# Altium schematic sheet clock-temp-touch.SchDoc
size A3; SPICEModelCacheRLVYLVLF: <root> / <DocumentId>RLVYLVLF</DocumentId> / <CacheFrame Number="0"> / <Model Name="dtunnel1" Kind="CKT"> / <Text>*Tunnel Diode Default / *MCE 600V 50A 27.2ns default parameters / *Diode Pinout: A,K / * Parameters: / * RS:  Series resistance value / * RP:  Negative resistance value in parallel with capacitance. / * CP:   Capacitance value in parallel with negative resistance. / * LS:  Series inductance value. / * / * / .SUBCKT DTUNNEL1 1 2 PARAMS: Rs=6 Rp=-75 Cp=0.6E-12 Ls=0.1nH / RS  1 3  {Rs} / RP  3 4  {Rp} / CP  3 4  {Cp} / LS  4 2  {Ls} / .ENDS DTUNNEL1</Text> / </Model> / </CacheFrame> / </root>
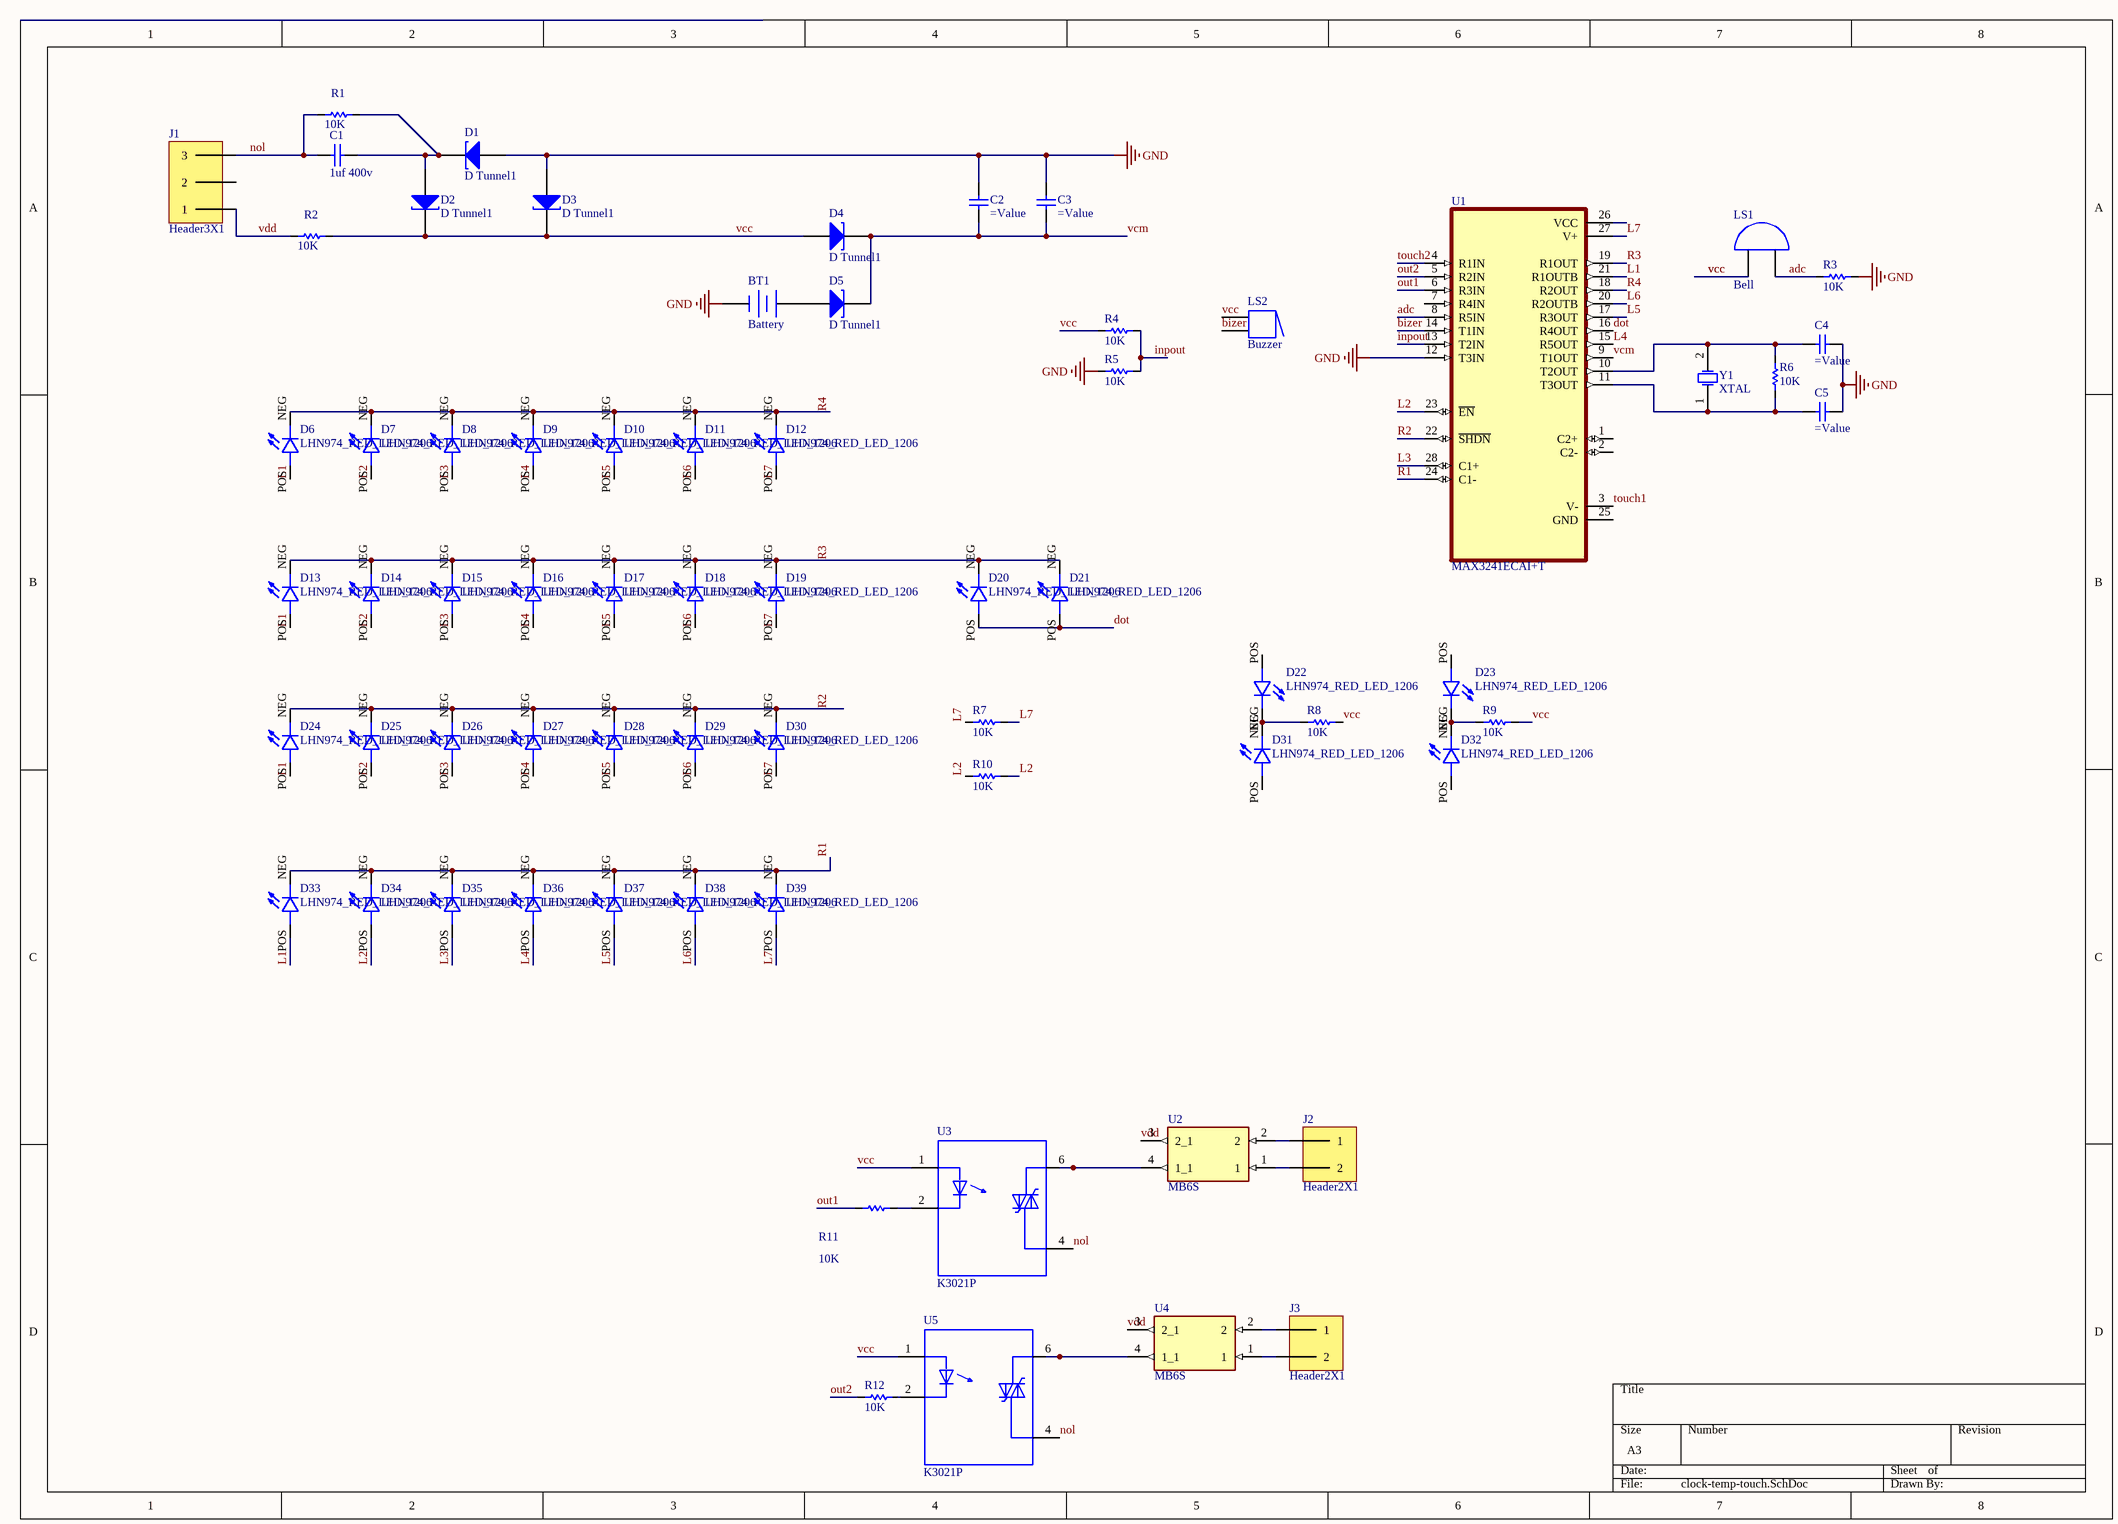
[diagram p0: clock-temp-touch.SchDoc]

## Parts
BT1  Battery  [BAT-2]
C1  1uf 400v  [1uf 400v]
C2  (no value)  [CAP 1206]
C3  (no value)  [CAP 1206]
C4  (no value)  [CAP 1206]
C5  (no value)  [CAP 1206]
D1  D Tunnel1  [3.2X1.6X1.1]
D2  D Tunnel1  [3.2X1.6X1.1]
D3  D Tunnel1  [3.2X1.6X1.1]
D4  D Tunnel1  [3.2X1.6X1.1]
D5  D Tunnel1  [3.2X1.6X1.1]
D6  LHN974_RED_LED_1206  [LEDC3216X120N]
D7  LHN974_RED_LED_1206  [LEDC3216X120N]
D8  LHN974_RED_LED_1206  [LEDC3216X120N]
D9  LHN974_RED_LED_1206  [LEDC3216X120N]
D10  LHN974_RED_LED_1206  [LEDC3216X120N]
D11  LHN974_RED_LED_1206  [LEDC3216X120N]
D12  LHN974_RED_LED_1206  [LEDC3216X120N]
D13  LHN974_RED_LED_1206  [LEDC3216X120N]
D14  LHN974_RED_LED_1206  [LEDC3216X120N]
D15  LHN974_RED_LED_1206  [LEDC3216X120N]
D16  LHN974_RED_LED_1206  [LEDC3216X120N]
D17  LHN974_RED_LED_1206  [LEDC3216X120N]
D18  LHN974_RED_LED_1206  [LEDC3216X120N]
D19  LHN974_RED_LED_1206  [LEDC3216X120N]
D20  LHN974_RED_LED_1206  [LEDC3216X120N]
D21  LHN974_RED_LED_1206  [LEDC3216X120N]
D22  LHN974_RED_LED_1206  [LEDC3216X120N]
D23  LHN974_RED_LED_1206  [LEDC3216X120N]
D24  LHN974_RED_LED_1206  [LEDC3216X120N]
D25  LHN974_RED_LED_1206  [LEDC3216X120N]
D26  LHN974_RED_LED_1206  [LEDC3216X120N]
D27  LHN974_RED_LED_1206  [LEDC3216X120N]
D28  LHN974_RED_LED_1206  [LEDC3216X120N]
D29  LHN974_RED_LED_1206  [LEDC3216X120N]
D30  LHN974_RED_LED_1206  [LEDC3216X120N]
D31  LHN974_RED_LED_1206  [LEDC3216X120N]
D32  LHN974_RED_LED_1206  [LEDC3216X120N]
D33  LHN974_RED_LED_1206  [LEDC3216X120N]
D34  LHN974_RED_LED_1206  [LEDC3216X120N]
D35  LHN974_RED_LED_1206  [LEDC3216X120N]
D36  LHN974_RED_LED_1206  [LEDC3216X120N]
D37  LHN974_RED_LED_1206  [LEDC3216X120N]
D38  LHN974_RED_LED_1206  [LEDC3216X120N]
D39  LHN974_RED_LED_1206  [LEDC3216X120N]
J1  Header3X1  [HEADER 3X1]
J2  Header2X1  [Header 2X1]
J3  Header2X1  [Header 2X1]
LS1  Bell  [PIN2]
LS2  Buzzer  [ABSM-1574]
R1  10K  [RES 1206 (3216X08L)]
R2  10K  [Res-(2/1)]
R3  10K  [RES 1206 (3216X08L)]
R4  10K  [RES 1206 (3216X08L)]
R5  10K  [RES 1206 (3216X08L)]
R6  10K  [RES 1206 (3216X08L)]
R7  10K  [RES 1206 (3216X08L)]
R8  10K  [RES 1206 (3216X08L)]
R9  10K  [RES 1206 (3216X08L)]
R10  10K  [RES 1206 (3216X08L)]
R11  10K  [RES 1206 (3216X08L)]
R12  10K  [RES 1206 (3216X08L)]
U1  MAX3241ECAI+T  [SOP65P777X199-28N]
U2  MB6S  [SOIC245P670X270-4N]
U3  K3021P  [DIP762W50P254L730H410Q6]
U4  MB6S  [SOIC245P670X270-4N]
U5  K3021P  [DIP762W50P254L730H410Q6]
Y1  XTAL  [R38]

## Nets
GND: BT1.2(-) C2.2(-) C3.2(-) C4.1(+) C5.1(+) D1.1(A) D3.1(A) R3.1 R5.2 U1.12(T3IN)
adc: LS1.2(B) R3.2 U1.8(R5IN)
bizer: LS2.2 LS2.2A U1.14(T1IN)
dot: D20.POS D21.POS U1.16(R4OUT)
inpout: R4.1 R5.1 U1.13(T2IN)
L1: D6.POS D13.POS D24.POS D33.POS U1.21(R1OUTB)
L2: D7.POS D14.POS D25.POS D34.POS R10.1 R10.2 U1.23(~{EN})
L3: D8.POS D15.POS D26.POS D35.POS U1.28(C1+)
L4: D9.POS D16.POS D27.POS D36.POS U1.15(R5OUT)
L5: D10.POS D17.POS D28.POS D37.POS U1.17(R3OUT)
L6: D11.POS D18.POS D29.POS D38.POS U1.20(R2OUTB)
L7: D12.POS D19.POS D30.POS D39.POS R7.1 R7.2 U1.27(V+)
nol: C1.1 J1.3 R1.1 U3.4(MT1) U5.4(MT1)
out1: R11.2 U1.6(R3IN)
out2: R12.2 U1.5(R2IN)
R1: D33.NEG D34.NEG D35.NEG D36.NEG D37.NEG D38.NEG D39.NEG U1.24(C1-)
R2: D24.NEG D25.NEG D26.NEG D27.NEG D28.NEG D29.NEG D30.NEG U1.22(~{SHDN})
R3: D13.NEG D14.NEG D15.NEG D16.NEG D17.NEG D18.NEG D19.NEG D20.NEG D21.NEG U1.19(R1OUT)
R4: D6.NEG D7.NEG D8.NEG D9.NEG D10.NEG D11.NEG D12.NEG U1.18(R2OUT)
touch1: U1.3(V-)
touch2: U1.4(R1IN)
vcc: D2.2(K) D3.2(K) D4.1(A) LS1.1(A) LS2.1 LS2.1A R2.2 R4.2 R8.1 R9.1 U3.1(A) U5.1(A)
vcm: C2.1(+) C3.1(+) D4.2(K) D5.2(K) U1.9(T1OUT)
vdd: J1.1 R2.1 U2.3(2_1) U4.3(2_1)
NetBT1_1: BT1.1(+) D5.1(A)
NetC1_2: C1.2 D1.2(K) D2.1(A) R1.2
NetC4_2: C4.2(-) R6.2 U1.10(T2OUT) Y1.2(OSC2)
NetC5_2: C5.2(-) R6.1 U1.11(T3OUT) Y1.1(OSC1)
NetD22_NEG: D22.NEG D31.NEG R8.2
NetD23_NEG: D23.NEG D32.NEG R9.2
NetJ2_1: J2.1 U2.2
NetJ2_2: J2.2 U2.1
NetJ3_1: J3.1 U4.2
NetJ3_2: J3.2 U4.1
NetR11_1: R11.1 U3.2(C)
NetR12_1: R12.1 U5.2(C)
NetU2_4: U2.4(1_1) U3.6(MT2)
NetU4_4: U4.4(1_1) U5.6(MT2)

Not connected (* = marked no-connect by the designer): D22 POS; D23 POS; D31 POS; D32 POS; J1 2; U1 1(C2+) 2(C2-) 7(R4IN) 25(GND) 26(VCC)

## Library data of the parts
BT1 = Battery: Multicell Battery; Published: 24-Mar-1999; LatestRevisionDate: 17-Jul-2002; LatestRevisionNote: Re-released for DXP Platform.; PackageReference: BAT-2; Publisher: Altium Limited; PackageDescription: Battery; 2 Leads
C1 = 1uf 400v: Capacitor 24*9mm; Designer: Seyed Mohsen Ghasemain; Value: 1uF; ComponentLinkURL: www.picpars.com
C2-C5 = Capacitor
D1-D5 = D Tunnel1: Tunnel Diode - RLC Model; Published: 8-Jun-2000; LatestRevisionDate: 17-Jul-2002; LatestRevisionNote: Re-released for DXP Platform.; PackageVersion: Feb-2002; PackageReference: 3.2X1.6X1.1; Publisher: Altium Limited; PackageDescription: SM LED; 2 Flat Leads
D6-D39 = LHN974_RED_LED_1206: 2.6 V Red LED SMD; MP: LHN974 RED LED 1206; MF: Osram; SnapEDA_Link: https://www.snapeda.com/parts/LHN974%20RED%20LED%201206/Osram/view-part/7899607/?ref=snap; Availability: Not in stock; Price: None; Check_prices: https://www.snapeda.com/parts/LHN974%20RED%20LED%201206/Osram/view-part/7899607/?ref=eda; Value: *; Package: None
LS1 = Bell: Electrical Bell; Published: 24-Mar-1999; LatestRevisionDate: 17-Jul-2002; LatestRevisionNote: Re-released for DXP Platform.; PackageReference: PIN2; Publisher: Altium Limited
LS2 = Buzzer: Magnetic Transducer Buzzer; Published: 24-Mar-1999; LatestRevisionDate: 17-Dec-2003; LatestRevisionNote: Schematic revised, PCB Footprint replaced.; DatasheetVersion: 17-Dec-2003; PackageReference: ABSM-1574; Publisher: Altium Limited; PackageDescription: Magnetic Transducer Buzzer; ComponentLink1Description: Manufacturer Link; ComponentLink1URL: http://www.megastar.com/linecard/buzzmode/index.php
R1-R12 = Resistor: Tolerance: 5%; Power: 1/4 W; Value: 10K
U1 = MAX3241ECAI+T: ±15kV ESD-Protected, Down to 10nA, 3.0V to 5.5V, Up to 1Mbps, True RS-232 Transceivers; MF: Analog Devices; SnapEDA_Link: https://www.snapeda.com/parts/MAX3241ECAI+T/Analog+Devices/view-part/?ref=snap; Package: SSOP-28 Maxim; Value: *; MP: MAX3241ECAI+T; Check_prices: https://www.snapeda.com/parts/MAX3241ECAI+T/Analog+Devices/view-part/?ref=eda
U2 U4 = MB6S: Bridge Rectifier Single Phase Standard 600V Surface Mount 4-SOIC; MF: ON Semiconductor; Digi-Key_Purchase_URL: https://www.digikey.com.tr/product-detail/en/on-semiconductor/MB6S/MB6SCT-ND/965654?utm_source=snapeda&utm_medium=aggregator&utm_campaign=symbol; Value: *; Package: BESOP-4 Surge Components; Digi-Key_Part_Number: MB6SCT-ND; SnapEDA_Link: https://www.snapeda.com/parts/MB6S/ON%20Semiconductor/view-part/2774209/?ref=snap; MP: MB6S
U3 U5 = K3021P: Optoisolator Triac Output 5300Vrms 1 Channel 6-DIP; MF: Vishay Semiconductor; Package: DIP-6 Vishay; Availability: Unavailable; Value: *; MP: K3021P; Mouser-Purchase-URL: https://snapeda.com/shop?store=Mouser&id=291595; SnapEDA_Link: https://www.snapeda.com/parts/K3021P/Vishay%20Semiconductor%20Opto%20Division/view-part/291595/?ref=snap; Price: None; DigiKey-Purchase-URL: https://snapeda.com/shop?store=DigiKey&id=291595
Y1 = XTAL: Crystal Oscillator; Published: 8-Jun-2000; LatestRevisionDate: 17-Jul-2002; LatestRevisionNote: Re-released for DXP Platform.; PackageReference: R38; Publisher: Altium Limited; PackageDescription: Crystal, Thru-Hole; 2 Leads; Body 3.1 x 8.2 mm (Dia.xH)